# EAGLE design 48x_49x Breakout Board RevC (EAGLE 9.6.2)
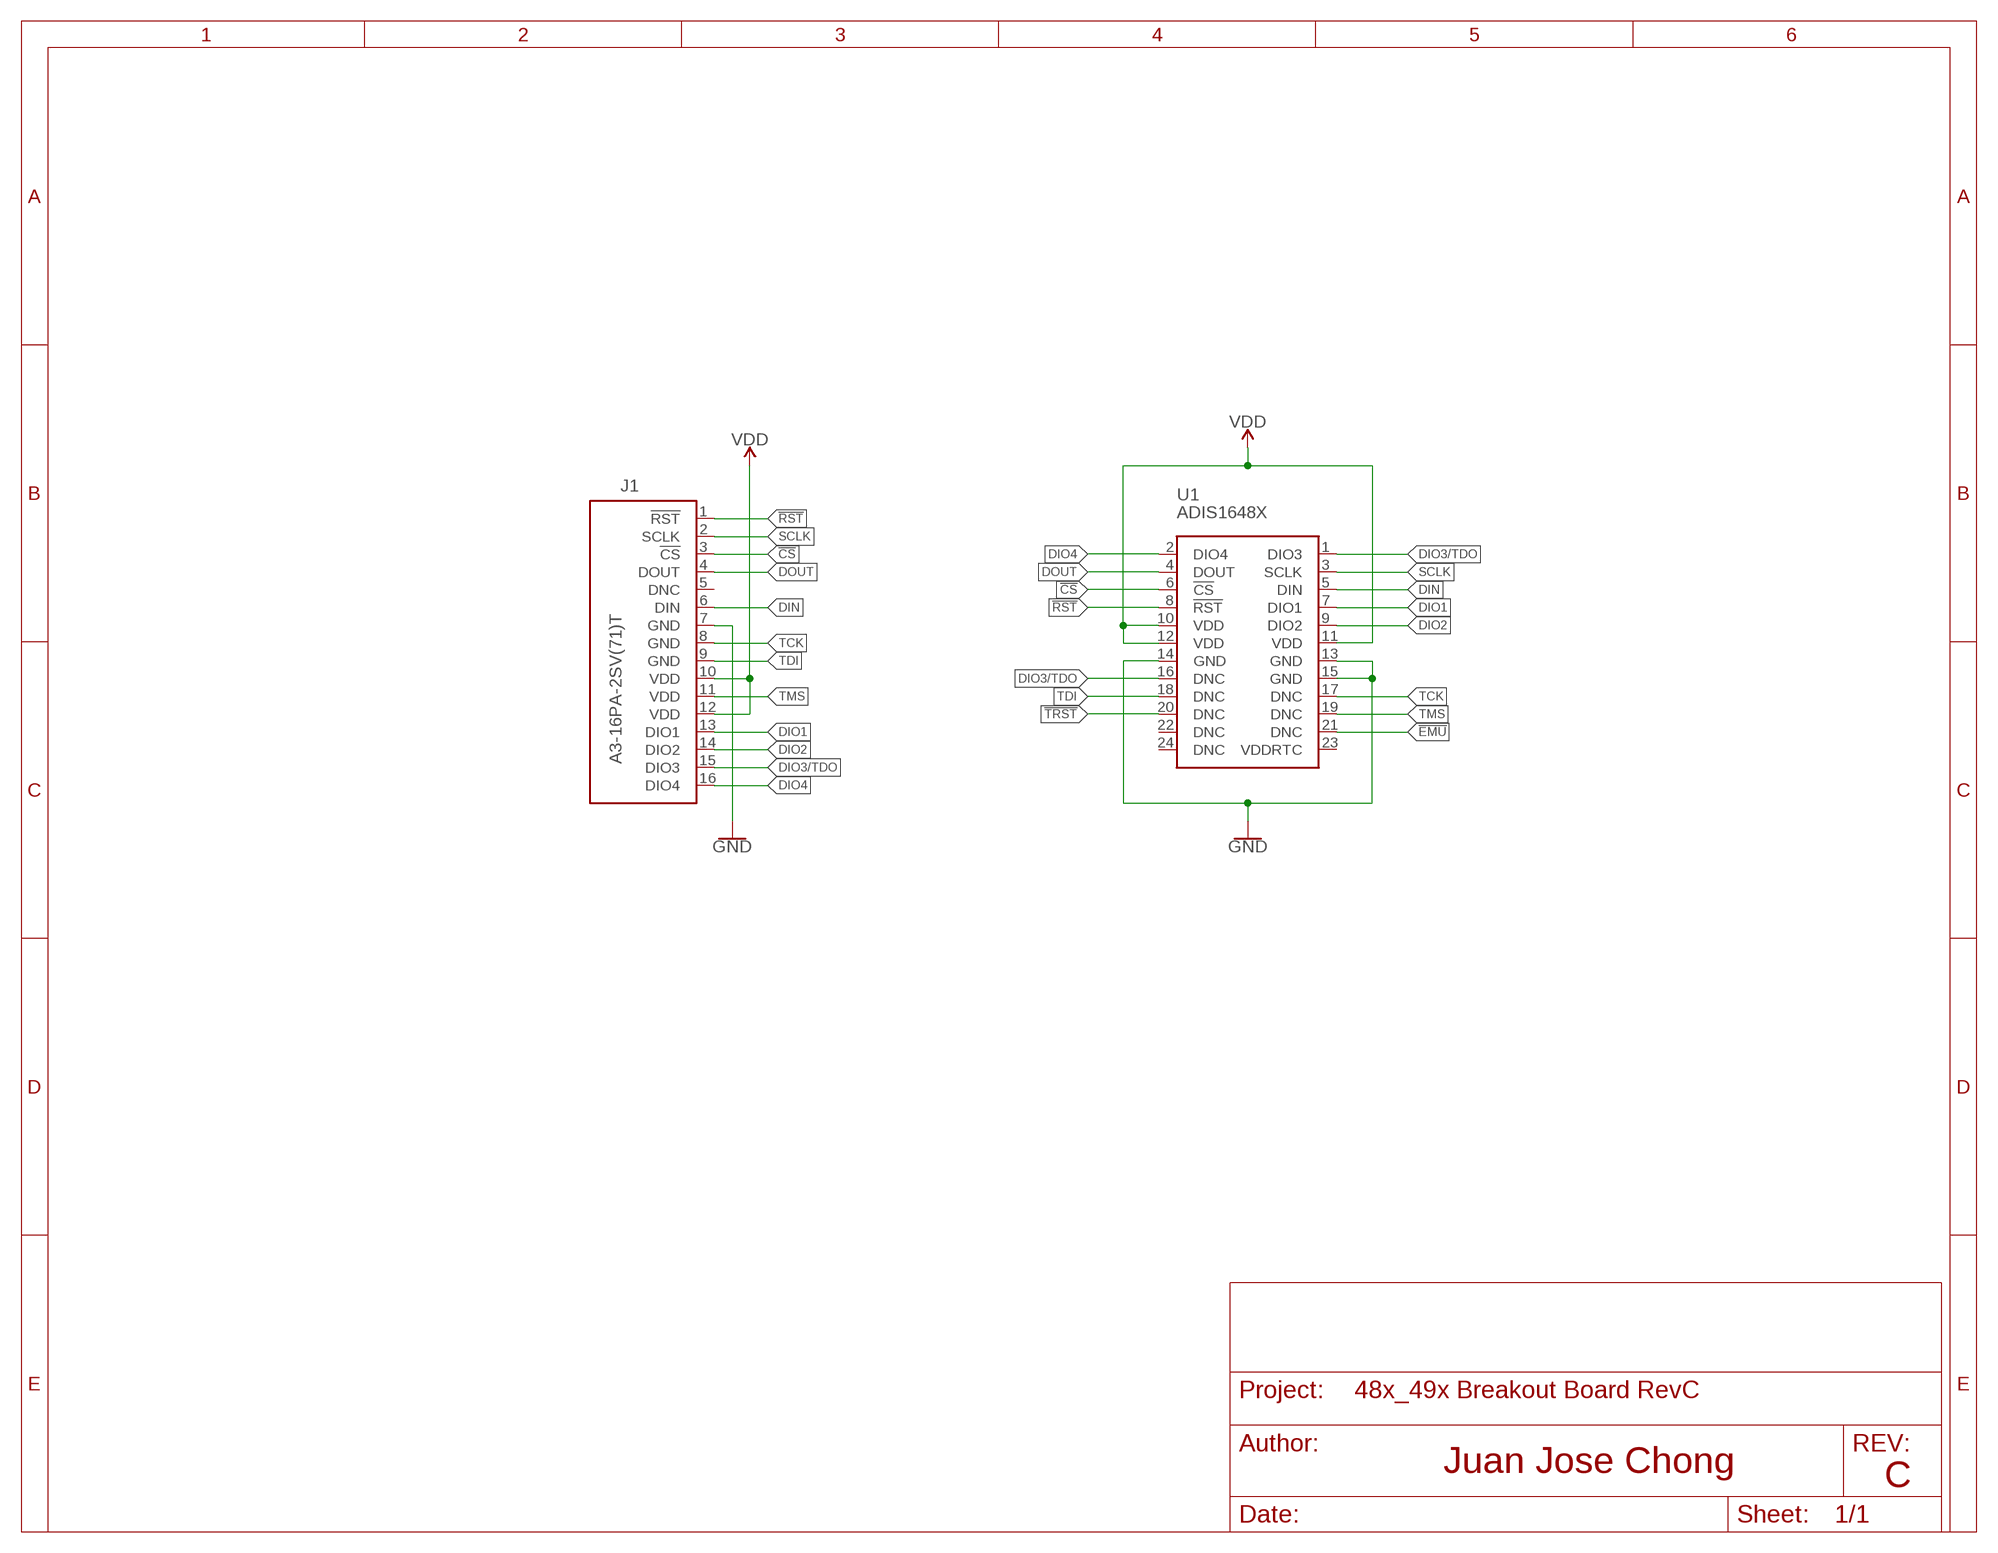
[diagram p0: schematic, sheet 1]

## Parts
J1  A3-16PA-2SV(71)T  [A3-16PA-2SV(71)-TOP]
U1  ADIS1648X  [ADIS1648X]

## Nets
!CS: J1.3(!CS) U1.6(!CS)
!EMU: U1.21(DNC)
!RST: J1.1(!RST) U1.8(!RST)
!TRST: U1.20(DNC)
DIN: J1.6(DIN) U1.5(DIN)
DIO1: J1.13(DIO1) U1.7(DIO1)
DIO2: J1.14(DIO2) U1.9(DIO2)
DIO3/TDO: J1.15(DIO3) U1.1(DIO3) U1.16(DNC)
DIO4: J1.16(DIO4) U1.2(DIO4)
DOUT: J1.4(DOUT) U1.4(DOUT)
GND: J1.7(GND) U1.13(GND) U1.14(GND) U1.15(GND)
SCLK: J1.2(SCLK) U1.3(SCLK)
TCK: J1.8(GND) U1.17(DNC)
TDI: J1.9(GND) U1.18(DNC)
TMS: J1.11(VDD) U1.19(DNC)
VDD: J1.10(VDD) J1.12(VDD) U1.10(VDD) U1.11(VDD) U1.12(VDD)
Unconnected: J1.5(DNC) U1.22(DNC) U1.23(VDDRTC) U1.24(DNC)

## Notes on the sheet
- C

## Library data of the parts
J1 = Analog Devices iSensors:A3-16PA-2SV(71)
U1 = Analog Devices iSensors:ADIS1648X

## Board
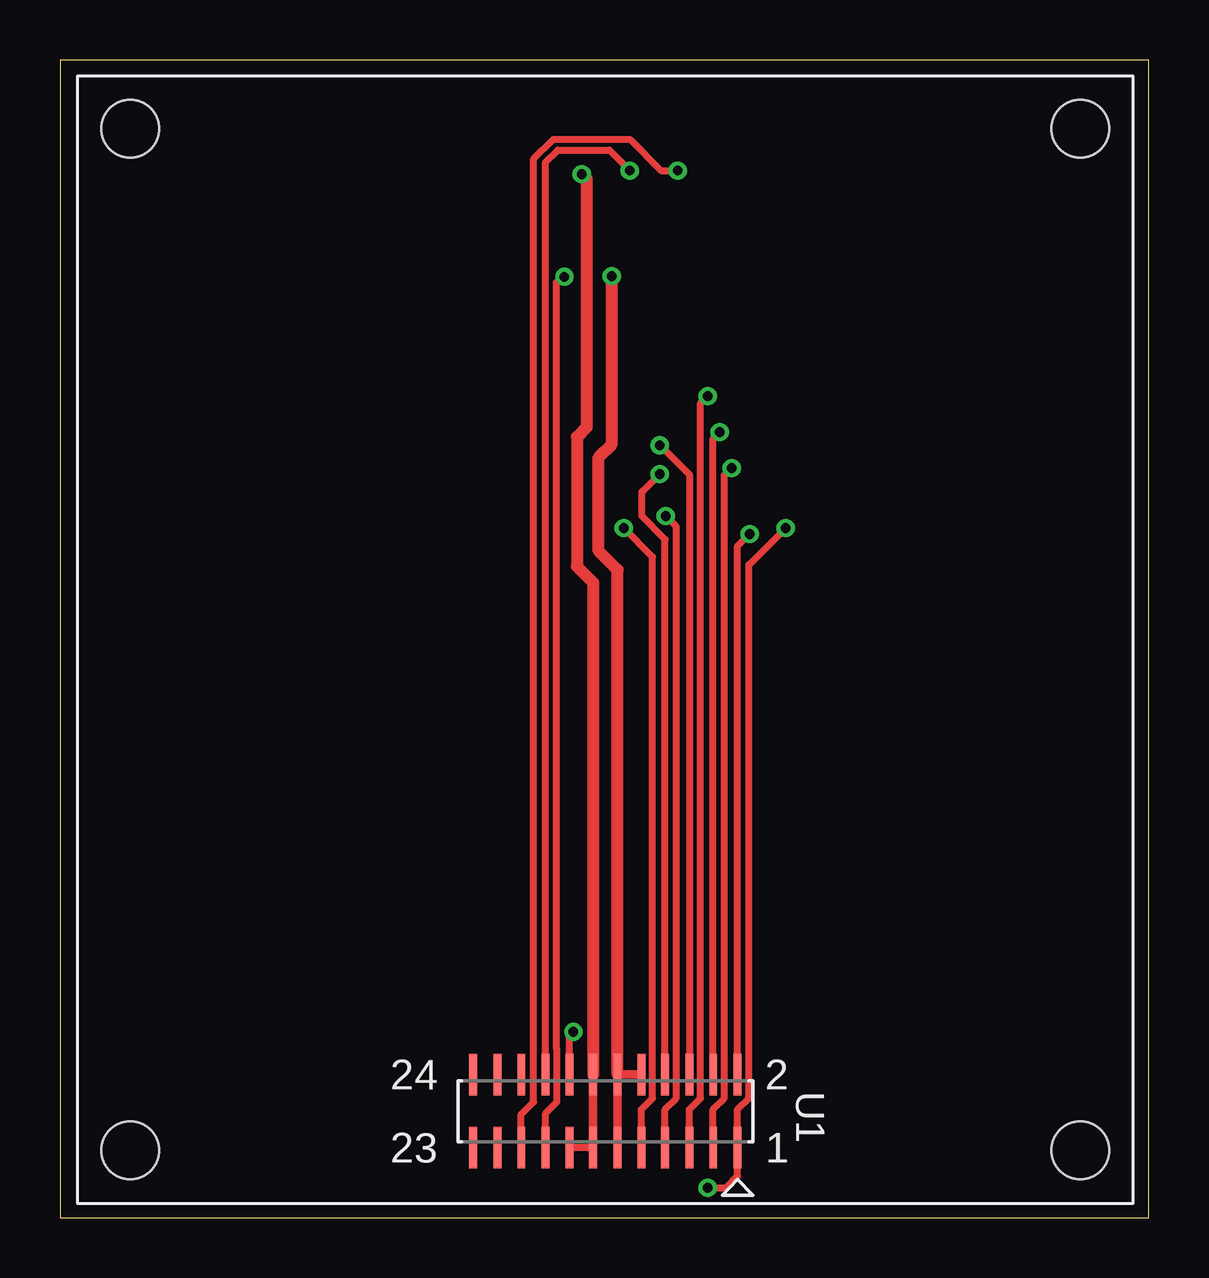
[diagram p1: board, top side]
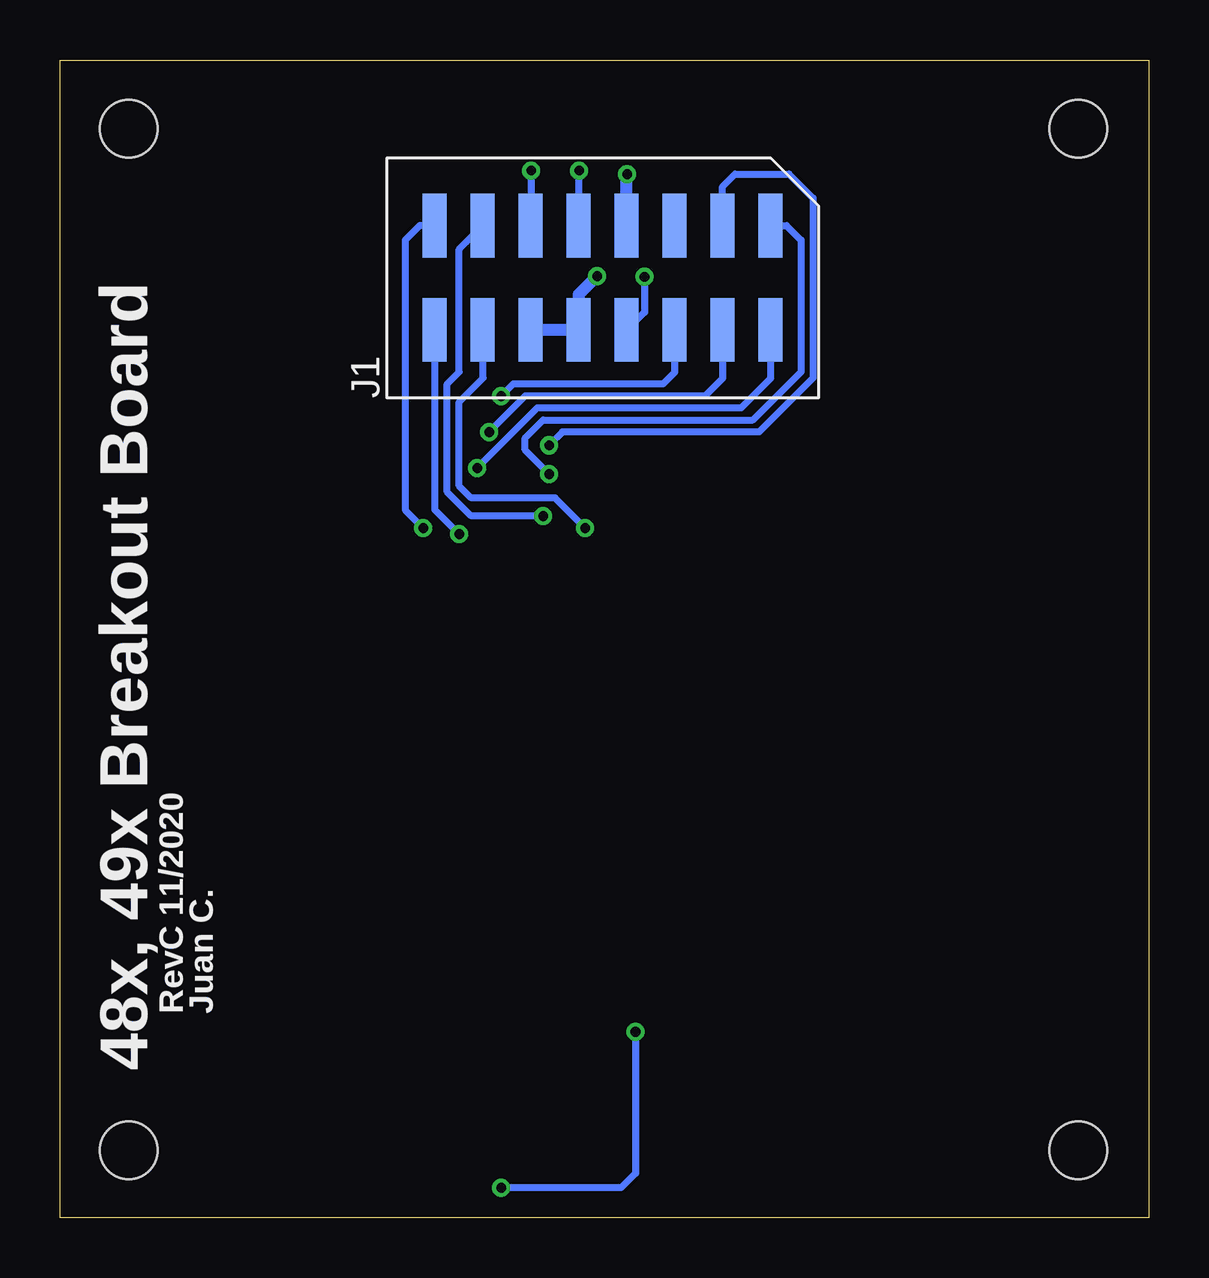
[diagram p2: board, bottom side, seen from below]

Size 45.39 x 48.26 mm. Coordinates in mm from the lower left corner, seen from the top.
Outline: 0,0 45.39,0 45.39,48.26 0,48.26 0,0
Copper layers (1*16): Top 0.0356mm / dielectric 1.5011mm / Bottom 0.0356mm
Design rules "LaenPCBOrder_FilledVias": minimum track width 6mil, minimum drill 10mil, track to track 6mil, track to pad 6mil, pad to pad 6mil, via to via 6mil, smd to smd 6mil, copper to edge 15mil, drill to drill 6mil, minimum pad ring 7mil, minimum via ring 7mil, stop-mask expansion 4mil, vias tented up to drill 20mil, thermal gap 10mil

### Footprints (pad centres in the part's own frame; a part is rotated, then mirrored left to right if it is on the bottom)
A3-16PA-2SV(71)-TOP = smd 1 x 2.65: 1 -7,-2.225; 2 -7,2.125; 3 -5,-2.225; 4 -5,2.125; 5 -3,-2.225; 6 -3,2.125; 7 -1,-2.225; 8 -1,2.125; 9 1,-2.225; 10 1,2.125; 11 3,-2.225; 12 3,2.125; 13 5,-2.225; 14 5,2.125; 15 7,-2.225; 16 7,2.125
ADIS1648X = smd 0.33 x 1.727: 1 5.512,-1.524; 2 5.512,1.524; 3 4.496,-1.524; 4 4.496,1.524; 5 3.505,-1.524; 6 3.505,1.524; 7 2.489,-1.524; 8 2.489,1.524; 9 1.499,-1.524; 10 1.499,1.524; 11 0.508,-1.524; 12 0.508,1.524; 13 -0.508,-1.524; 14 -0.508,1.524; 15 -1.499,-1.524; 16 -1.499,1.524; 17 -2.489,-1.524; 18 -2.489,1.524; 19 -3.505,-1.524; 20 -3.505,1.524; 21 -4.496,-1.524; 22 -4.496,1.524; 23 -5.512,-1.524; 24 -5.512,1.524 | hole 2.4: -19.8,-1.642; 19.8,-1.642; 19.8,40.958; -19.8,40.958

### Placement (x,y rotation side)
J1  22.77,39.13 180 bottom
U1  22.73,4.45 0 top

### Tracks (layer width: path | path; a pad name or v marks a point on that pad's centre or on a via)
!CS  (via drill 0.4)
  Top 0.3: U1.6 26.24,6.49 26.25,6.5 26.25,30.95 v25,32.2
  Bottom 0.3: J1.3 17.77,42.98 17.25,43.5 15,43.5 14,42.5 14,35 16.25,32.75 24.45,32.75 v25,32.2
!RST  (via drill 0.4)
  Top 0.3: U1.8 25.22,28.28 24.25,29.25 24.25,30.25 v25,31
  Bottom 0.3: J1.1 15.11,41.35 14.5,40.75 14.5,35.25 16.5,33.25 25.25,33.25 26,32.5 26,32 v25,31
DIN  (via drill 0.4)
  Top 0.3: U1.5 26.24,4.51 26.71,4.98 26.71,33.96 v27,34.25
  Bottom 0.3: J1.6 19.77,35.23 20.25,34.75 26.5,34.75 v27,34.25
DIO1  (via drill 0.4)
  Top 0.3: U1.7 25.22,4.51 25.69,4.98 25.69,6.96 25.69,28.81 v25.25,29.25
  Bottom 0.3: v25.25,29.25 28.25,29.25 29.25,30.25 29.25,34.75 28.75,35.25 28.75,40.37 J1.13
DIO2  (via drill 0.4)
  Top 0.3: U1.9 24.23,4.51 24.7,4.98 24.7,27.55 v23.5,28.75
  Bottom 0.3: v23.5,28.75 24.75,30 28.25,30 28.75,30.5 28.75,34 27.75,35 27.75,36.99 J1.14
DIO3/TDO  (via drill 0.4)
  Top 0.3: v30.25,28.75 28.71,27.21 28.71,4.98 28.25,4.51 U1.1 28.25,1.75 27.75,1.25 v27,1.25 | U1.16 21.23,7.58 v21.4,7.75
  Bottom 0.3: J1.15 30.39,41.35 31,40.75 31,29.5 v30.25,28.75 | v21.4,7.75 21.4,1.85 22,1.25 v27,1.25
DIO4  (via drill 0.4)
  Top 0.3: U1.2 28.25,28 v28.75,28.5
  Bottom 0.3: J1.16 29.77,29.52 v28.75,28.5
DOUT  (via drill 0.4)
  Top 0.3: U1.4 27.23,32.48 v27.5,32.75
  Bottom 0.3: J1.4 17.77,34.98 18.5,34.25 26,34.25 v27.5,32.75
GND  (via drill 0.4)
  Top 0.3: U1.15 22.17,2.92 U1.13
  Top 0.35: U1.14 22.23,2.98 22.17,2.92
  Top 0.5: v21.75,43.5 21.95,43.3 21.95,32.95 21.55,32.55 21.55,27.15 22.23,26.48 U1.14
  Bottom 0.5: J1.7 21.77,43.48 v21.75,43.5
SCLK  (via drill 0.4)
  Top 0.3: U1.3 27.23,4.51 27.7,4.98 27.7,30.95 v28,31.25
  Bottom 0.3: J1.2 15.77,34.98 17,33.75 25.5,33.75 v28,31.25
TCK  (via drill 0.4)
  Top 0.3: U1.17 20.24,4.36 20.71,4.83 20.71,7.06 20.7,7.07 20.7,39 20.98,39.27 v21.02,39.23
  Bottom 0.3: v21.02,39.23 21.02,37.75 J1.8
TDI  (via drill 0.4)
  Top 0.3: U1.18 20.24,43.99 20.75,44.5 22.9,44.5 v23.75,43.65
  Bottom 0.3: v23.75,43.65 23.77,43.63 J1.9
TMS  (via drill 0.4)
  Top 0.3: U1.19 19.23,4.31 19.75,4.83 19.75,44.13 20.56,44.95 23.76,44.95 25.06,43.65 v25.75,43.65
  Bottom 0.3: v25.75,43.65 25.75,41.37 J1.11
VDD  (via drill 0.4)
  Top 0.3: U1.10
  Top 0.35: U1.11 U1.12 U1.10
  Top 0.5: U1.12 23.24,27.01 22.45,27.8 22.45,31.7 23,32.25 v23,39.25
  Bottom 0.5: J1.12 J1.10 23.77,38.48 v23,39.25

### Text on the board
bNames: 48x, 49x Breakout Board | Juan C. | RevC 11/2020